# Altium project DAQ_Replacement.PrjPcb (part 3 of 3)

## Sheet GPIO_5V_LEVEL_SHIFTER.SchDoc
size A4
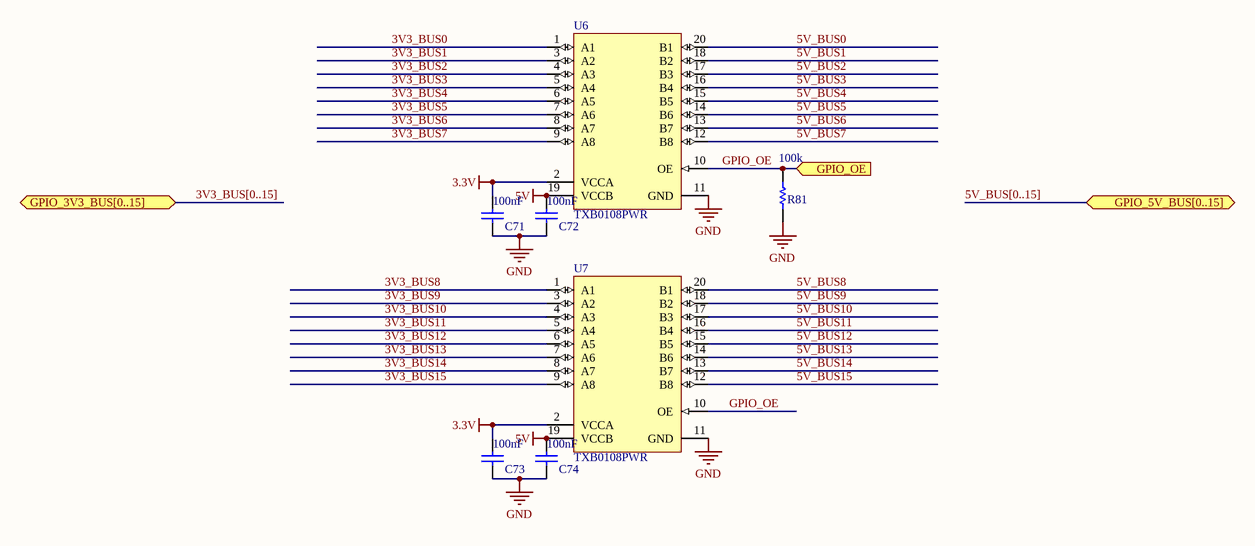
[diagram p12: GPIO_5V_LEVEL_SHIFTER.SchDoc]

### Parts
C71  value 100nF  [CAPC0402(1005)60_L]  (hidden comment: CAP0402)
C72  value 100nF  [CAPC0402(1005)60_L]  (hidden comment: CAP0402)
C73  value 100nF  [CAPC0402(1005)60_L]  (hidden comment: CAP0402)
C74  value 100nF  [CAPC0402(1005)60_L]  (hidden comment: CAP0402)
R81  value 100k  [RESC0402(1005)_L]  (hidden comment: RES0402)
U6  TXB0108PWR  [PW0020A_N]
U7  TXB0108PWR  [PW0020A_N]

### Ports
GPIO_3V3_BUS[0..15] (bidir), GPIO_5V_BUS[0..15] (bidir), GPIO_OE (in)

### Nets
3.3V: C71.1 C73.1 U6.2(VCCA) U7.2(VCCA)
5V: C72.1 C74.1 U6.19(VCCB) U7.19(VCCB)
GND: C71.2 C72.2 C73.2 C74.2 R81.1 U6.11(GND) U7.11(GND)
3V3_BUS0: U6.1(A1)
3V3_BUS1: U6.3(A2)
3V3_BUS2: U6.4(A3)
3V3_BUS3: U6.5(A4)
3V3_BUS4: U6.6(A5)
3V3_BUS5: U6.7(A6)
3V3_BUS6: U6.8(A7)
3V3_BUS7: U6.9(A8)
3V3_BUS8: U7.1(A1)
3V3_BUS9: U7.3(A2)
3V3_BUS10: U7.4(A3)
3V3_BUS11: U7.5(A4)
3V3_BUS12: U7.6(A5)
3V3_BUS13: U7.7(A6)
3V3_BUS14: U7.8(A7)
3V3_BUS15: U7.9(A8)
5V_BUS0: U6.20(B1)
5V_BUS1: U6.18(B2)
5V_BUS2: U6.17(B3)
5V_BUS3: U6.16(B4)
5V_BUS4: U6.15(B5)
5V_BUS5: U6.14(B6)
5V_BUS6: U6.13(B7)
5V_BUS7: U6.12(B8)
5V_BUS8: U7.20(B1)
5V_BUS9: U7.18(B2)
5V_BUS10: U7.17(B3)
5V_BUS11: U7.16(B4)
5V_BUS12: U7.15(B5)
5V_BUS13: U7.14(B6)
5V_BUS14: U7.13(B7)
5V_BUS15: U7.12(B8)
GPIO_OE: R81.2 U6.10(OE) U7.10(OE) ; port GPIO_OE

### Buses and harness runs
bus 3V3_BUS[0..15] = port GPIO_3V3_BUS[0..15]
bus 5V_BUS[0..15] = port GPIO_5V_BUS[0..15]

### Library data of the parts
C71-C74 = CMP-1590-00004-1: as C123-C133 on sheet MCU_USB; PackageReference: CAPC0402(1005)60
R81 = CMP-1591-00004-1: as R121-R125 on sheet MCU_USB; PackageReference: RESC0402(1005)
U6 U7 = CMP-2000-07337-1: TXB0108 8-Bit Bidirectional Voltage-Level Translator with Auto-Direction Sensing and / +/- 15-kV ESD Protection, 1.2 to 3.6 V, -40 to 85 degC, 20-Pin TSSOP (PW), Green (RoHS & no Sb/Br), Tape and Reel; Manufacturer: Texas Instruments; Propagation Delay (Max): 4ns; Logic Function: Translator,Bidirectional; Input Type: Logic; Package Version: 4040064-5/G, 02/2011; Voltage - Supply: 1.2V~3.6V,1.65V~5.5V; Data Rate: 100Mbps; Other Names: 296-21527-6; Number of Channels: 8; Differential - Input: Output:No/No; Number of Outputs/Channel: 1; Product Training Modules: VoltageLevelTranslation; Dynamic Catalog: TXBSeries; Package Reference: PW20; Package Description: 20-Pin Small Outline Package Integrated Circuit, Body 6.5 x 4.4 mm, Pitch 0.65 mm; Category: IntegratedCircuits(ICs); Datasheet URL: http://www.ti.com/general/docs/lit/getliterature.tsp?genericPartNumber=TXB0108&fileType=pdf; Package / Case: 20-TSSOP(0.173",4.40mmWidth); Family: Logic-Translators; Standard Package: 1; Series: -; Manufacturer URL: http://www.ti.com/; Number of Bits: 8; Package URL: http://www.ti.com/litv/pdf/mpds362; Output Type: Logic; Datasheet Version: Rev. F, 12/2014; Packaging: Digi-Reel®; Operating Temperature: -40°C~85°C; Supplier Device Package: 20-TSSOP; Mounting Technology: SurfaceMount

## Sheet VOLTAGE_REFERENCE.SchDoc
size A4
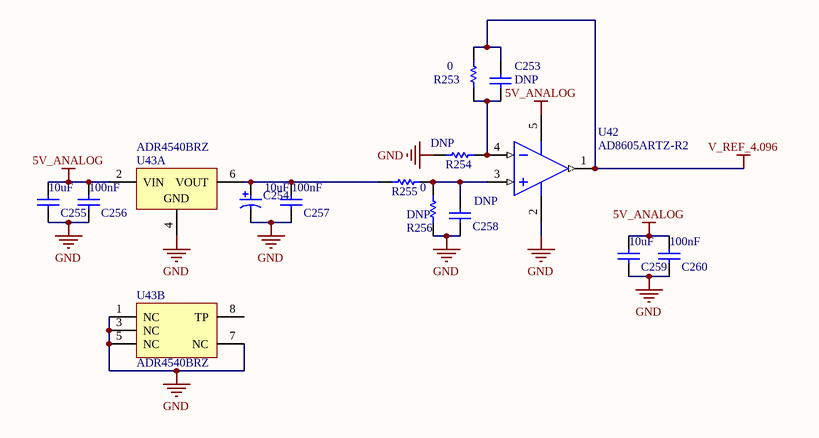
[diagram p13: VOLTAGE_REFERENCE.SchDoc]

### Parts
C253  value DNP  [CAPC0402(1005)60_L]  (hidden comment: CAP0402)
C254  Capacitance: 10uF  [KEMT-A-3216-18-2_M]  (hidden comment: T491A106K016AT)
C255  value 10uF  [CAPC0805(2012)145_L]  (hidden comment: CAP0805)
C256  value 100nF  [CAPC0402(1005)60_L]  (hidden comment: CAP0402)
C257  value 100nF  [CAPC0402(1005)60_L]  (hidden comment: CAP0402)
C258  value DNP  [CAPC0402(1005)60_L]  (hidden comment: CAP0402)
C259  value 10uF  [CAPC0805(2012)145_L]  (hidden comment: CAP0805)
C260  value 100nF  [CAPC0402(1005)60_L]  (hidden comment: CAP0402)
R253  value 0  [RESC0402(1005)_L]  (hidden comment: RES0402)
R254  value DNP  [RESC0402(1005)_L]  (hidden comment: RES0402)
R255  value 0  [RESC0402(1005)_L]  (hidden comment: RES0402)
R256  value DNP  [RESC0402(1005)_L]  (hidden comment: RES0402)
U42  AD8605ARTZ-R2  [ADI-RJ-5_L]
U43  ADR4540BRZ  [ADI-R-8_M]  (parts A,B of 2)

### Nets
5V_ANALOG: C255.2 C256.1 C259.2 C260.1 U42.5(+V) U43.2(VIN)
GND: C254.2 C255.1 C256.2 C257.2 C258.2 C259.1 C260.2 R254.1 R256.2 U42.2(-V) U43.1(NC) U43.3(NC) U43.4(GND) U43.5(NC) U43.7(NC)
V_REF_4.096: C253.1 R253.1 U42.1(OUT)
NetC253_2: C253.2 R253.2 R254.2 U42.4(-IN)
NetC254_1: C254.1 C257.1 R255.1 U43.6(VOUT)
NetC258_1: C258.1 R255.2 R256.1 U42.3(+IN)

Not connected (* = marked no-connect by the designer): U43 8(TP)

### Library data of the parts
C253 C256-C258 C260 = CMP-1590-00004-1: as C123-C133 on sheet MCU_USB; PackageReference: CAPC0402(1005)60
C254 = CMP-2000-05173-1: Capacitor, Tantalum, 10 uF, +/- 10%, 16 V, -55 to 125 degC, 2-Pin SMD (1206), RoHS, Tape and Reel; Manufacturer: Kemet; Insulation: NotRequired; Voltage: 16VDC; Product Height (mm): 1.6mm; Polarity: Polar; Lead Spacing (nom): NotRequiredmm; Product Length (mm): 3.2mm; Case Style: Molded; DCL: 1.6uA; ESR: 7ohm; DF: 8%; Mounting Style: SurfaceMount; Manufacturer URL: http://www.kemet.com/; Datasheet Version: Apr-14; Package Description: 2-Pin Surface Mount Device, Body 3.2 x 1.6 mm; Operating Temp Range: -55Cto125C; Package Reference: 1206; Wire Form: NotRequired; Datasheet URL: http://www.farnell.com/datasheets/1824869.pdf; Tolerance (+ or -): 10%; Failure Rate: NotRequired; Length W/Weld: NotRequiredmm; Package / Case: 3216-18; Seated Plane Height: NotRequiredmm; Product Diameter (mm): NotRequiredmm; Construction: SMTChip; Seal: NotRequired; Case Code: A; Product Depth (mm): 1.6mm; Packaging: TapeandReel
C255 C259 = CMP-1590-00003-1: 0805 (2012 Metric) Chip Capacitor; Case-EIA: 0805; Case-Metric: 2012; PackageReference: CAPC0805(2012)145
R253-R256 = CMP-1591-00004-1: as R121-R125 on sheet MCU_USB; PackageReference: RESC0402(1005)
U42 = CMP-0384-01518-1: Single Channel Wide Bandwidth Operational Amplifier, 10 MHz BW, 5 V/us SR, Industrial, 5-pin SOT23 (RJ-5), Reel; Generic Part Number: AD8605; Manufacturer: Analog Devices; Input Offset Voltage: 20uV; Small Signal Bandwidth: 10MHz; Slew Rate: 5V/us; V Span Min: 2.7V; Amplifiers Per Package: 1; Input Bias Current: 200fA; V Span Max: 6V; Iq/Amp: 1.2mA; ComponentLink2URL: http://www.analog.com/static/imported-files/data_sheets/AD8605_8606_8608.pdf; Code_JEDEC: MO-178-AA; ComponentLink1URL: http://www.analog.com/en/index.html; ComponentLink1Description: Manufacturer URL; Mounting Technology: Surface Mount; PackageReference: RJ-5; ComponentLink3Description: Package Specification; ComponentLink3URL: http://www.analog.com/static/imported-files/packages/PKG_PDF/SOT-23(RJ)/RJ_5.pdf; PackageDescription: 5-Pin Small Outline Transistor Package, Body 2.9 x 1.6 mm, Pitch 0.95 mm; PackageVersion: 121608-A; PartNumber: AD8605ARTZ-R2; ComponentLink2Description: Datasheet; ComponentLink4Description: URL Link1; ComponentLink4URL: Reference Circuit:http://www.analog.com/en/all-operational-amplifiers-op-amps/operational-amplifiers-op-amps/ad8605/products/product.html#product-recommendations; DatasheetVersion: Rev. L
U43 = CMP-0784-00192-1: Ultralow Noise, High Accuracy Voltage Reference, 4.096 V Output, 3 to 15 V Supply, Industrial, 8-pin SOIC (R-8), Tube; Manufacturer: Analog Devices; Max V Supply (V): 15; Min V Supply (V): 3; Vout: 4.096V; Ref Out TC (ppm/C): 2; ComponentLink4URL: Product URL:http://www.analog.com/en/special-linear-functions/voltage-references/adr4540/products/product.html; Mounting Technology: Surface Mount; ComponentLink1Description: Manufacturer URL; PackageDescription: 8-Pin Standard Small Outline Package, Body 4.9 x 3.9 mm, Pitch 1.27 mm; ComponentLink2URL: http://www.analog.com/static/imported-files/data_sheets/ADR4520_4525_4530_4533_4540_4550.pdf; ComponentLink1URL: http://www.analog.com/en/index.html; DatasheetVersion: Rev. 0; ComponentLink4Description: URL Link1; Operating Temp Range: -40 to 125 degC; PartNumber: ADR4540BRZ; ComponentLink2Description: Datasheet; ComponentLink3URL: http://www.analog.com/static/imported-files/packages/PKG_PDF/SOIC_Narrow%20(R)/R_8.pdf; ComponentLink3Description: Package Specification; PackageVersion: 060506-A, 06/2006; Packing: Tube; PackageReference: R-8; Code_JEDEC: MS-012-AA

## Sheet PSU_USB_MCU.SchDoc
size A4
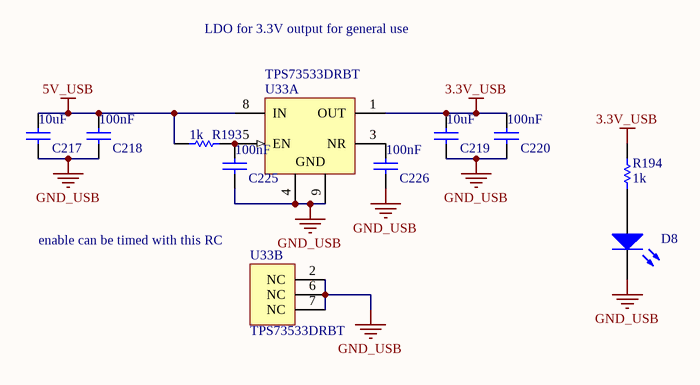
[diagram p14: PSU_USB_MCU.SchDoc]

### Parts
C217  value 10uF  [CAPC0805(2012)145_L]  (hidden comment: CAP0805)
C218  value 100nF  [CAPC0402(1005)60_L]  (hidden comment: CAP0402)
C219  value 10uF  [CAPC0805(2012)145_L]  (hidden comment: CAP0805)
C220  value 100nF  [CAPC0402(1005)60_L]  (hidden comment: CAP0402)
C225  value 100nF  [CAPC0402(1005)60_L]  (hidden comment: CAP0402)
C226  value 100nF  [CAPC0402(1005)60_L]  (hidden comment: CAP0402)
D8  Green_LED_150060GS75000  [Green_LED_150060GS75000]  (value not drawn)
R193  value 1k  [RESC0402(1005)_L]  (hidden comment: RES0402)
R194  value 1k  [RESC0402(1005)_L]  (hidden comment: RES0402)
U33  TPS73533DRBT  [DRB0008A_V]  (parts A,B of 2)

### Nets
3.3V_USB: C219.2 C220.1 R194.1 U33.1(OUT)
5V_USB: C217.2 C218.1 R193.2 U33.8(IN)
GND_USB: C217.1 C218.2 C219.1 C220.2 C225.2 C226.2 D8.1 U33.2(NC) U33.4(GND) U33.6(NC) U33.7(NC) U33.9(GND)
NetC225_1: C225.1 R193.1 U33.5(EN)
NetC226_1: C226.1 U33.3(NR)
NetD8_2: D8.2 R194.2

### Notes on the sheet
- LDO for 3.3V output for general use
- enable can be timed with this RC

### Library data of the parts
C217 C219 = CMP-1590-00003-1: as C255 on sheet VOLTAGE_REFERENCE; PackageReference: CAPC0805(2012)145
C218 C220 C225 C226 = CMP-1590-00004-1: as C123-C133 on sheet MCU_USB; PackageReference: CAPC0402(1005)60
D8 = Green_LED_150060GS75000: WURTH ELEKTRONIK  150060GS75000  LED, Green, SMD, 30 mA, 3.2 V, 520 nm; Unit Cost: 0.287; ComponentLinkURL1: http://ie.farnell.com/wurth-elektronik/150060gs75000/led-0603-green-430mcd-520nm/dp/2322070?ost=150060GS75000&selectedCategoryId=&categoryNameResp=All%2BCategories&searchView=table&iscrfnonsku=false; Manufacturer Part Number: 150060GS75000; Supplier 1: Farnell; Supplier Part Number 1: 2322070; Manufacturer: WURTH ELEKTRONIK
R193 R194 = CMP-1591-00004-1: as R121-R125 on sheet MCU_USB; PackageReference: RESC0402(1005)
U33 = CMP-0395-00583-2: Single Output High PSRR LDO, 500 mA, Fixed 3.3 V Output, 2.7 to 6.5 V Input, with Low IQ, 8-pin SON (DRB), -40 to 125 degC, Green (RoHS & no Sb/Br); Manufacturer: Texas Instruments; SubFamily: Single Channel LDO; Vout Adj(Min)(V): 3.3; Iq(Typ)(mA): 0.04; Vdo(Typ)(mV): 280; Vin(Min)(V): 2.7; Vin(Max)(V): 6.5; Accuracy(%): 2; Iout(Max)(A): 0.5; ComponentLink3Description: Package Specification; ComponentLink2Description: Datasheet; DatasheetVersion: SBVS087J; ComponentLink1Description: Manufacturer URL; PartNumber: TPS73533DRBT; ComponentLink2URL: http://www.ti.com/general/docs/lit/getliterature.tsp?genericPartNumber=TPS73533&fileType=pdf; ComponentLink3URL: http://www.ti.com/litv/pdf/mpds118h; Fixed Output Options(V): 3.3; Eco-Plan: Green (RoHS & no Sb/Br); ComponentLink1URL: http://www.ti.com/; PackageDescription: 8-Pin Plastic Small Outline, Body 3 x 3 mm, Pitch 0.65 mm; Mounting Technology: Surface Mount; PackageVersion: 4203482-2/K; Vout Adj(Max)(V): 3.3; PackageReference: DRB0008A

## Sheet PSU_DAQ_MCU.SchDoc
size A4
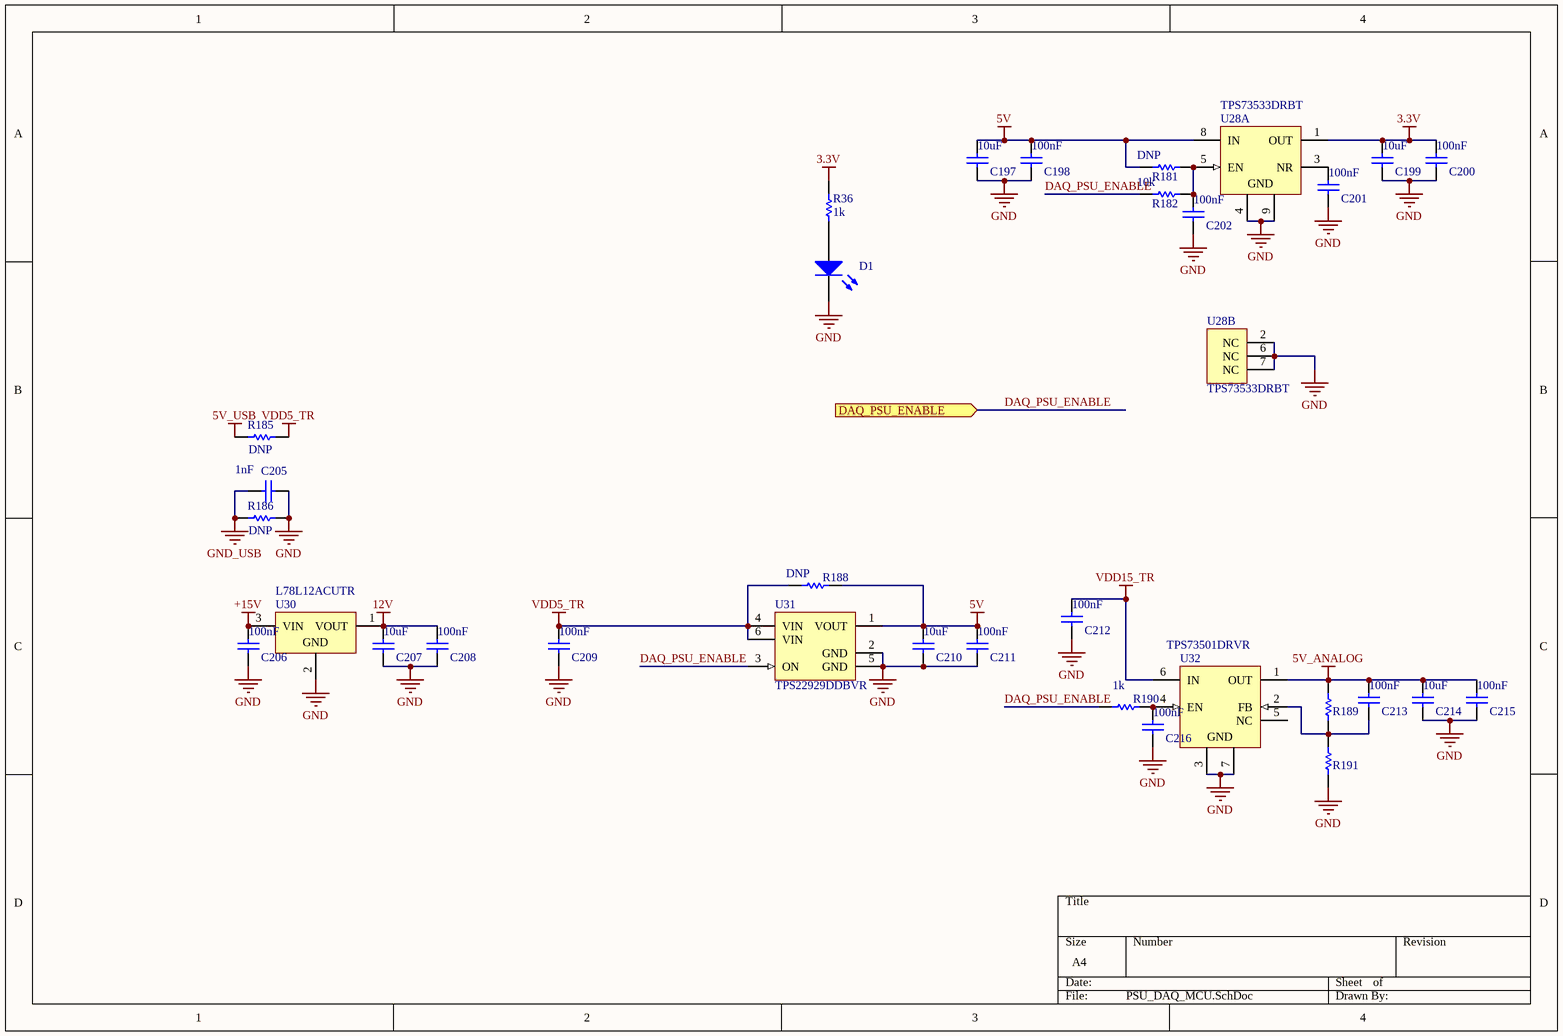
[diagram p15: PSU_DAQ_MCU.SchDoc]

### Parts
C197  value 10uF  [CAPC0805(2012)145_L]  (hidden comment: CAP0805)
C198  value 100nF  [CAPC0402(1005)60_L]  (hidden comment: CAP0402)
C199  value 10uF  [CAPC0805(2012)145_L]  (hidden comment: CAP0805)
C200  value 100nF  [CAPC0402(1005)60_L]  (hidden comment: CAP0402)
C201  value 100nF  [CAPC0402(1005)60_L]  (hidden comment: CAP0402)
C202  value 100nF  [CAPC0402(1005)60_L]  (hidden comment: CAP0402)
C205  value 1nF  [CAPC1808(4520)175_L]  (hidden comment: CAP1808)
C206  value 100nF  [CAPC0402(1005)60_L]  (hidden comment: CAP0402)
C207  value 10uF  [CAPC0805(2012)145_L]  (hidden comment: CAP0805)
C208  value 100nF  [CAPC0402(1005)60_L]  (hidden comment: CAP0402)
C209  value 100nF  [CAPC0402(1005)60_L]  (hidden comment: CAP0402)
C210  value 10uF  [CAPC0805(2012)145_L]  (hidden comment: CAP0805)
C211  value 100nF  [CAPC0402(1005)60_L]  (hidden comment: CAP0402)
C212  value 100nF  [CAPC0402(1005)60_L]  (hidden comment: CAP0402)
C213  value 100nF  [CAPC0402(1005)60_L]  (hidden comment: CAP0402)
C214  value 10uF  [CAPC0805(2012)145_L]  (hidden comment: CAP0805)
C215  value 100nF  [CAPC0402(1005)60_L]  (hidden comment: CAP0402)
C216  value 100nF  [CAPC0402(1005)60_L]  (hidden comment: CAP0402)
D1  Green_LED_150060GS75000  [Green_LED_150060GS75000]  (value not drawn)
R36  value 1k  [RESC0402(1005)_L]  (hidden comment: RES0402)
R181  value DNP  [RESC0402(1005)_L]  (hidden comment: RES0402)
R182  value 10k  [RESC0402(1005)_L]  (hidden comment: RES0402)
R185  value DNP  [RESC2010(5025)_L]  (hidden comment: RES2010)
R186  value DNP  [RESC2010(5025)_L]  (hidden comment: RES2010)
R188  value DNP  [RESC0402(1005)_L]  (hidden comment: RES0402)
R189  RES0402  [RESC0402(1005)_L]  (value not drawn)
R190  value 1k  [RESC0402(1005)_L]  (hidden comment: RES0402)
R191  RES0402  [RESC0402(1005)_L]  (value not drawn)
U28  TPS73533DRBT  [DRB0008A_V]  (parts A,B of 2)
U30  L78L12ACUTR  [SOT-89_N]
U31  TPS22929DDBVR  [DBV6_N]
U32  TPS73501DRVR  [TI-DRV6-1600X1000TP_V]

### Ports
DAQ_PSU_ENABLE (in)

### Nets
3.3V: C199.2 C200.1 R36.1 U28.1(OUT)
5V: C197.2 C198.1 C210.2 C211.1 R181.1 R188.1 U28.8(IN) U31.1(VOUT)
5V_ANALOG: C213.1 C214.2 C215.1 R189.1 U32.1(OUT)
5V_USB: R185.1
12V: C207.2 C208.1 U30.1(VOUT)
+15V: C206.1 U30.3(VIN)
GND: C197.1 C198.2 C199.1 C200.2 C201.2 C202.2 C205.2 C206.2 C207.1 C208.2 C209.2 C210.1 C211.2 C212.2 C214.1 C215.2 C216.2 D1.1 R186.2 R191.2 U28.2(NC) U28.4(GND) U28.6(NC) U28.7(NC) U28.9(GND) U30.2(GND) U31.2(GND) U31.5(GND) U32.3(GND) U32.7(GND)
GND_USB: C205.1 R186.1
VDD5_TR: C209.1 R185.2 R188.2 U31.4(VIN) U31.6(VIN)
VDD15_TR: C212.1 U32.6(IN)
DAQ_PSU_ENABLE: R182.1 R190.2 U31.3(ON) ; port DAQ_PSU_ENABLE
NetC201_1: C201.1 U28.3(NR)
NetC202_1: C202.1 R181.2 R182.2 U28.5(EN)
NetC213_2: C213.2 R189.2 R191.1 U32.2(FB)
NetC216_1: C216.1 R190.1 U32.4(EN)
NetD1_2: D1.2 R36.2

Not connected (* = marked no-connect by the designer): U32 5(NC)

### Library data of the parts
C197 C199 C207 C210 C214 = CMP-1590-00003-1: as C255 on sheet VOLTAGE_REFERENCE; PackageReference: CAPC0805(2012)145
C198 C200-C202 C206 C208 C209 C211-C213 C215 C216 = CMP-1590-00004-1: as C123-C133 on sheet MCU_USB; PackageReference: CAPC0402(1005)60
C205 = CMP-1590-00006-1: 1808 (4520 Metric) Chip Capacitor; Case-Metric: 4520; Case-EIA: 1808; PackageReference: CAPC1808(4520)175
D1 = Green_LED_150060GS75000: as D8 on sheet PSU_USB_MCU; ComponentLinkURL1: http://ie.farnell.com/wurth-elektronik/150060gs75000/led-0603-green-430mcd-520nm/dp/2322070?ost=150060GS75000&selectedCategoryId=&categoryNameResp=All%2BCategories&searchView=table&iscrfnonsku=false; Manufacturer Part Number: 150060GS75000; Supplier 1: Farnell; Supplier Part Number 1: 2322070; Manufacturer: WURTH ELEKTRONIK
R36 R181 R182 R188-R191 = CMP-1591-00004-1: as R121-R125 on sheet MCU_USB; PackageReference: RESC0402(1005)
R185 R186 = CMP-1591-00006-1: 2010 (5025 Metric) Chip Resistor; Case-Metric: 5025; Case-EIA: 2010; PackageReference: RESC2010(5025)
U28 = CMP-0395-00583-2: as U33 on sheet PSU_USB_MCU; ComponentLink3Description: Package Specification; ComponentLink2Description: Datasheet; DatasheetVersion: SBVS087J; ComponentLink1Description: Manufacturer URL; PartNumber: TPS73533DRBT; ComponentLink2URL: http://www.ti.com/general/docs/lit/getliterature.tsp?genericPartNumber=TPS73533&fileType=pdf; ComponentLink3URL: http://www.ti.com/litv/pdf/mpds118h; Fixed Output Options(V): 3.3; Eco-Plan: Green (RoHS & no Sb/Br); ComponentLink1URL: http://www.ti.com/; PackageDescription: 8-Pin Plastic Small Outline, Body 3 x 3 mm, Pitch 0.65 mm; Mounting Technology: Surface Mount; PackageVersion: 4203482-2/K; Vout Adj(Max)(V): 3.3; PackageReference: DRB0008A
U30 = CMP-0244-00387-1: Positive Voltage Regulator, 12V, 4-Pin SOT-89, Tape and Reel; DatasheetVersion: 1/02/2011; PackageDescription: 3-Pin SOT-89 Package 1.5 mm Pitch, 4.1 mm Lead Span; ComponentLink2Description: Datasheet; ComponentLink1Description: Manufacturer URL; PackageVersion: 2011; PackageReference: SOT-89; ComponentLink1URL: http://www.st.com; ComponentLink2URL: http://www.st.com/internet/com/TECHNICAL_RESOURCES/TECHNICAL_LITERATURE/DATASHEET/CD00000446.pdf
U31 = CMP-0330-00011-1: Low Input Voltage, 1.8 A Single Channel Load Switch with Controlled Turn-On, 1.8 V Logic Compatible, 1.8 A, 1.4 to 5.5 V, -40 to 85 degC, 6-pin SOT-23 (DBV), Green (RoHS & no Sb/Br); Manufacturer: Texas Instruments; Quick Output Discharge Transistor: Yes; SubFamily: Non Current Limited Load Switch; Iin(nA): 10000; Control Logic: 1.8-V Logic Compatible; HBM ESD(kV): 2; Vin(V): 1.4 - 5.5; Active High Enable: TRUE; Output Rise Time(ÂµS): 4500; Imax(A): 1.8; rON @1.8V(mOhm): 85; PartNumber: TPS22929DDBVR; Eco-Plan: Green (RoHS & no Sb/Br); ComponentLink1Description: Datasheet; DatasheetVersion: SLVSB39; PackageReference: DBV6; PackageVersion: revK, Mar-2006; PackageDescription: 6-Pin Plastic Small-Outline Package, 2.9 x 1.6 mm Body, 0.95 mm Pitch, 2.8 mm Lead Span; ComponentLink1URL: http://www.ti.com/general/docs/lit/getliterature.tsp?genericPartNumber=TPS22929D&fileType=pdf; Code_JEDEC: MO-178-AB*; Mounting Technology: Surface Mount
U32 = CMP-0395-00669-1: Single Output High PSRR LDO, 500 mA, Adjustable 1.25 to 6 V Output, 2.7 to 6.5 V Input, with Low IQ, 6-pin SON (DRV), -40 to 125 degC, Green (RoHS & no Sb/Br); Manufacturer: Texas Instruments; SubFamily: Single Channel LDO; Vin(Max)(V): 6.5; Vin(Min)(V): 2.7; Vout Adj(Min)(V): 1.25; Vdo(Typ)(mV): 280; Accuracy(%): 2; Iout(Max)(A): 0.5; Iq(Typ)(mA): 0.04; Vout Adj(Max)(V): 6; ComponentLink1Description: Manufacturer URL; ComponentLink2URL: http://www.ti.com/general/docs/lit/getliterature.tsp?genericPartNumber=TPS73501&fileType=pdf; PackageReference: DRV6-1600X1000TP; ComponentLink2Description: Datasheet; Mounting Technology: Surface Mount; PackageVersion: 4206925/E; DatasheetVersion: SBVS087J; Eco-Plan: Green (RoHS & no Sb/Br); ComponentLink1URL: http://www.ti.com/; PartNumber: TPS73501DRVR; ComponentLink3URL: http://www.ti.com/litv/pdf/mpds216d; PackageDescription: 6-Pin Plastic Small Outline No-Lead, Body 2 x 2 mm, Pitch 0.65 mm; ComponentLink3Description: Package Specification

## Nets that join several sheets
3.3V: ADC1 (9 pins), ADC2 (9 pins), OPTO_ISOLATION (8 pins), DIAGNOSTIC_ADC (5 pins), MCU_DAQ (20 pins), MCU_USB (R139.2 R140.2), Phase_Modulator_Transmitter (7 pins), INPUTS_OUTPUTS (R94.1), GPIO_5V_LEVEL_SHIFTER (C71.1 C73.1 U6.2 U7.2), PSU_DAQ_MCU (C199.2 C200.1 R36.1 U28.1)
3.3V_USB: USB (Q4.3 R236.2), OPTO_ISOLATION (8 pins), WIFI_BLE_Option (C261.1 R258.2 U45.4 U45.6), MCU_USB (20 pins), PSU_USB_MCU (C219.2 C220.1 R194.1 U33.1)
5V: ADC1 (C21_ADC1.1 C22_ADC1.2 U1_ADC1.27), ADC2 (C21_ADC2.1 C22_ADC2.2 U1_ADC2.27), DIAGNOSTIC_ADC (R67.1), INPUTS_OUTPUTS (DAQ1.1 DAQ1.2 DAQ1.51 DAQ1.52), GPIO_5V_LEVEL_SHIFTER (C72.1 C74.1 U6.19 U7.19), PSU_DAQ_MCU (8 pins)
5V_ANALOG: ADC1 (C19_ADC1.2 C20_ADC1.1 U1_ADC1.28), ADC2 (C19_ADC2.2 C20_ADC2.1 U1_ADC2.28), DIAGNOSTIC_ADC (R68.1), Phase_Modulator_Transmitter (5 pins), VOLTAGE_REFERENCE (6 pins), PSU_DAQ_MCU (5 pins)
5V_USB: USB (J4.1 R250.1 U41.4), PSU_USB_MCU (C217.2 C218.1 R193.2 U33.8), PSU_DAQ_MCU (R185.1)
12V: DIAGNOSTIC_ADC (R71.1), Phase_Modulator_Transmitter (R163.1 R164.1 R168.2 R169.2), PSU_DAQ_MCU (C207.2 C208.1 U30.1)
15V: ADC1 (C34_ADC1.1 C35_ADC1.2 U1_ADC1.39), ADC2 (C34_ADC2.1 C35_ADC2.2 U1_ADC2.39), DIAGNOSTIC_ADC (R69.1)
+15V: Bipolar_PSU_Sheet (5 pins), Phase_Modulator_Transmitter (6 pins), PSU_DAQ_MCU (C206.1 U30.3)
-15V: ADC1 (C32_ADC1.2 C33_ADC1.1 U1_ADC1.38 U1_ADC1.41), ADC2 (C32_ADC2.2 C33_ADC2.1 U1_ADC2.38 U1_ADC2.41), Bipolar_PSU_Sheet (5 pins), DIAGNOSTIC_ADC (R73.1), Phase_Modulator_Transmitter (6 pins)
GND: ADC1 (39 pins), ADC1/ADC_INPUT_FILTER (16 pins), ADC2 (39 pins), ADC2/ADC_INPUT_FILTER (16 pins), OPTO_ISOLATION (10 pins), Bipolar_PSU_Sheet (16 pins), DIAGNOSTIC_ADC (21 pins), MCU_DAQ (32 pins), Phase_Modulator_Transmitter (50 pins), INPUTS_OUTPUTS (58 pins), GPIO_5V_LEVEL_SHIFTER (7 pins), VOLTAGE_REFERENCE (15 pins), PSU_DAQ_MCU (30 pins)
GND_USB: USB (6 pins), OPTO_ISOLATION (9 pins), WIFI_BLE_Option (15 pins), MCU_USB (33 pins), PSU_USB_MCU (12 pins), PSU_DAQ_MCU (C205.1 R186.1)
V_REF_4.096: ADC1 (6 pins), ADC2 (6 pins), DIAGNOSTIC_ADC (R65.2 R70.1), VOLTAGE_REFERENCE (C253.1 R253.1 U42.1)
VDD5_TR: OPTO_ISOLATION (R150.2), INPUTS_OUTPUTS (P3.7 P3.8), PSU_DAQ_MCU (5 pins)
VDD15_TR: INPUTS_OUTPUTS (P3.1), PSU_DAQ_MCU (C212.1 U32.6)
VDD_AMP_TR: Bipolar_PSU_Sheet (FB4.2), INPUTS_OUTPUTS (P3.3)
VSS_AMP_TR: Bipolar_PSU_Sheet (FB3.1), INPUTS_OUTPUTS (P3.4)
3V3_BUS0: MCU_DAQ (U11.81), GPIO_5V_LEVEL_SHIFTER (U6.1)
3V3_BUS1: MCU_DAQ (U11.82), GPIO_5V_LEVEL_SHIFTER (U6.3)
3V3_BUS2: MCU_DAQ (U11.83), GPIO_5V_LEVEL_SHIFTER (U6.4)
3V3_BUS3: MCU_DAQ (U11.84), GPIO_5V_LEVEL_SHIFTER (U6.5)
3V3_BUS4: MCU_DAQ (U11.85), GPIO_5V_LEVEL_SHIFTER (U6.6)
3V3_BUS5: MCU_DAQ (U11.86), GPIO_5V_LEVEL_SHIFTER (U6.7)
3V3_BUS6: MCU_DAQ (U11.87), GPIO_5V_LEVEL_SHIFTER (U6.8)
3V3_BUS7: MCU_DAQ (U11.88), GPIO_5V_LEVEL_SHIFTER (U6.9)
3V3_BUS8: MCU_DAQ (U11.55), GPIO_5V_LEVEL_SHIFTER (U7.1)
3V3_BUS9: MCU_DAQ (U11.56), GPIO_5V_LEVEL_SHIFTER (U7.3)
3V3_BUS10: MCU_DAQ (U11.57), GPIO_5V_LEVEL_SHIFTER (U7.4)
3V3_BUS11: MCU_DAQ (U11.58), GPIO_5V_LEVEL_SHIFTER (U7.5)
3V3_BUS12: MCU_DAQ (U11.59), GPIO_5V_LEVEL_SHIFTER (U7.6)
3V3_BUS13: MCU_DAQ (U11.60), GPIO_5V_LEVEL_SHIFTER (U7.7)
3V3_BUS14: MCU_DAQ (U11.61), GPIO_5V_LEVEL_SHIFTER (U7.8)
3V3_BUS15: MCU_DAQ (U11.62), GPIO_5V_LEVEL_SHIFTER (U7.9)
5V_BUS0: INPUTS_OUTPUTS (DAQ1.3), GPIO_5V_LEVEL_SHIFTER (U6.20)
5V_BUS1: INPUTS_OUTPUTS (DAQ1.5), GPIO_5V_LEVEL_SHIFTER (U6.18)
5V_BUS2: INPUTS_OUTPUTS (DAQ1.7), GPIO_5V_LEVEL_SHIFTER (U6.17)
5V_BUS3: INPUTS_OUTPUTS (DAQ1.9), GPIO_5V_LEVEL_SHIFTER (U6.16)
5V_BUS4: INPUTS_OUTPUTS (DAQ1.11), GPIO_5V_LEVEL_SHIFTER (U6.15)
5V_BUS5: INPUTS_OUTPUTS (DAQ1.13), GPIO_5V_LEVEL_SHIFTER (U6.14)
5V_BUS6: INPUTS_OUTPUTS (DAQ1.15), GPIO_5V_LEVEL_SHIFTER (U6.13)
5V_BUS7: INPUTS_OUTPUTS (DAQ1.17), GPIO_5V_LEVEL_SHIFTER (U6.12)
5V_BUS8: INPUTS_OUTPUTS (DAQ1.69), GPIO_5V_LEVEL_SHIFTER (U7.20)
5V_BUS9: INPUTS_OUTPUTS (DAQ1.71), GPIO_5V_LEVEL_SHIFTER (U7.18)
5V_BUS10: INPUTS_OUTPUTS (DAQ1.73), GPIO_5V_LEVEL_SHIFTER (U7.17)
5V_BUS11: INPUTS_OUTPUTS (DAQ1.75), GPIO_5V_LEVEL_SHIFTER (U7.16)
5V_BUS12: INPUTS_OUTPUTS (DAQ1.77), GPIO_5V_LEVEL_SHIFTER (U7.15)
5V_BUS13: INPUTS_OUTPUTS (DAQ1.79), GPIO_5V_LEVEL_SHIFTER (U7.14)
5V_BUS14: INPUTS_OUTPUTS (DAQ1.81), GPIO_5V_LEVEL_SHIFTER (U7.13)
5V_BUS15: INPUTS_OUTPUTS (DAQ1.83), GPIO_5V_LEVEL_SHIFTER (U7.12)
ADC_INPUT0: ADC1/ADC_INPUT_FILTER (R1_ADC1_ADC_INPUT_FILTER.1 R2_ADC1_ADC_INPUT_FILTER.1), INPUTS_OUTPUTS (DAQ1.30)
ADC_INPUT1: ADC1/ADC_INPUT_FILTER (R3_ADC1_ADC_INPUT_FILTER.1 R4_ADC1_ADC_INPUT_FILTER.2), INPUTS_OUTPUTS (DAQ1.36)
ADC_INPUT2: ADC1/ADC_INPUT_FILTER (R5_ADC1_ADC_INPUT_FILTER.1 R6_ADC1_ADC_INPUT_FILTER.1), INPUTS_OUTPUTS (DAQ1.42)
ADC_INPUT3: ADC1/ADC_INPUT_FILTER (R7_ADC1_ADC_INPUT_FILTER.1 R8_ADC1_ADC_INPUT_FILTER.2), INPUTS_OUTPUTS (DAQ1.48)
ADC_INPUT4: ADC1/ADC_INPUT_FILTER (R9_ADC1_ADC_INPUT_FILTER.1 R10_ADC1_ADC_INPUT_FILTER.1), INPUTS_OUTPUTS (DAQ1.31)
ADC_INPUT5: ADC1/ADC_INPUT_FILTER (R11_ADC1_ADC_INPUT_FILTER.1 R12_ADC1_ADC_INPUT_FILTER.2), INPUTS_OUTPUTS (DAQ1.37)
ADC_INPUT6: ADC1/ADC_INPUT_FILTER (R13_ADC1_ADC_INPUT_FILTER.1 R14_ADC1_ADC_INPUT_FILTER.1), INPUTS_OUTPUTS (DAQ1.43)
ADC_INPUT7: ADC1/ADC_INPUT_FILTER (R15_ADC1_ADC_INPUT_FILTER.1 R16_ADC1_ADC_INPUT_FILTER.2), INPUTS_OUTPUTS (DAQ1.49)
ADC_OUTC0: Phase_Modulator_Transmitter (R175.1), INPUTS_OUTPUTS (DAQ1.39)
BUSY: ADC1 (R27_ADC1.2 R32_ADC1.1 U1_ADC1.19), MCU_DAQ (U11.96)
CNV: ADC1 (C36_ADC1.1 R33_ADC1.1 U1_ADC1.20), MCU_DAQ (U11.92)
CSB: ADC1 (R26_ADC1.2 R31_ADC1.1 U1_ADC1.11), MCU_DAQ (U11.51)
DAQ_PSU_ENABLE: OPTO_ISOLATION (U3.2), MCU_USB (U14.81 U14.83)
DAQ_PSU_ENABLE: OPTO_ISOLATION (U3.15), Bipolar_PSU_Sheet (U2.5 U4.5), PSU_DAQ_MCU (R182.1 R190.2 U31.3)
DIN: ADC1 (R28_ADC1.1 U1_ADC1.12), MCU_DAQ (U11.54), Phase_Modulator_Transmitter (U23.11)
GPIO_OE: MCU_DAQ (U11.40), GPIO_5V_LEVEL_SHIFTER (R81.2 U6.10 U7.10)
I2C3_SCL: OPTO_ISOLATION (U19.3), MCU_USB (R140.1 U14.67)
I2C3_SDA: OPTO_ISOLATION (U19.2), MCU_USB (R139.1 U14.66)
IN0_ADC1: ADC1 (U1_ADC1.1), ADC1/ADC_INPUT_FILTER (C1_ADC1_ADC_INPUT_FILTER.1 C2_ADC1_ADC_INPUT_FILTER.2 R2_ADC1_ADC_INPUT_FILTER.2)
IN0_ADC2: ADC2 (U1_ADC2.1), ADC2/ADC_INPUT_FILTER (C1_ADC2_ADC_INPUT_FILTER.1 C2_ADC2_ADC_INPUT_FILTER.2 R2_ADC2_ADC_INPUT_FILTER.2)
IN1_ADC1: ADC1 (U1_ADC1.2), ADC1/ADC_INPUT_FILTER (C2_ADC1_ADC_INPUT_FILTER.1 C3_ADC1_ADC_INPUT_FILTER.2 R3_ADC1_ADC_INPUT_FILTER.2)
IN1_ADC2: ADC2 (U1_ADC2.2), ADC2/ADC_INPUT_FILTER (C2_ADC2_ADC_INPUT_FILTER.1 C3_ADC2_ADC_INPUT_FILTER.2 R3_ADC2_ADC_INPUT_FILTER.2)
IN2_ADC1: ADC1 (U1_ADC1.3), ADC1/ADC_INPUT_FILTER (C4_ADC1_ADC_INPUT_FILTER.1 C5_ADC1_ADC_INPUT_FILTER.2 R6_ADC1_ADC_INPUT_FILTER.2)
IN2_ADC2: ADC2 (U1_ADC2.3), ADC2/ADC_INPUT_FILTER (C4_ADC2_ADC_INPUT_FILTER.1 C5_ADC2_ADC_INPUT_FILTER.2 R6_ADC2_ADC_INPUT_FILTER.2)
IN3_ADC1: ADC1 (U1_ADC1.4), ADC1/ADC_INPUT_FILTER (C5_ADC1_ADC_INPUT_FILTER.1 C6_ADC1_ADC_INPUT_FILTER.2 R7_ADC1_ADC_INPUT_FILTER.2)
IN3_ADC2: ADC2 (U1_ADC2.4), ADC2/ADC_INPUT_FILTER (C5_ADC2_ADC_INPUT_FILTER.1 C6_ADC2_ADC_INPUT_FILTER.2 R7_ADC2_ADC_INPUT_FILTER.2)
IN4_ADC1: ADC1 (U1_ADC1.6), ADC1/ADC_INPUT_FILTER (C7_ADC1_ADC_INPUT_FILTER.1 C8_ADC1_ADC_INPUT_FILTER.2 R10_ADC1_ADC_INPUT_FILTER.2)
IN4_ADC2: ADC2 (U1_ADC2.6), ADC2/ADC_INPUT_FILTER (C7_ADC2_ADC_INPUT_FILTER.1 C8_ADC2_ADC_INPUT_FILTER.2 R10_ADC2_ADC_INPUT_FILTER.2)
IN5_ADC1: ADC1 (U1_ADC1.7), ADC1/ADC_INPUT_FILTER (C8_ADC1_ADC_INPUT_FILTER.1 C9_ADC1_ADC_INPUT_FILTER.2 R11_ADC1_ADC_INPUT_FILTER.2)
IN5_ADC2: ADC2 (U1_ADC2.7), ADC2/ADC_INPUT_FILTER (C8_ADC2_ADC_INPUT_FILTER.1 C9_ADC2_ADC_INPUT_FILTER.2 R11_ADC2_ADC_INPUT_FILTER.2)
IN6_ADC1: ADC1 (U1_ADC1.8), ADC1/ADC_INPUT_FILTER (C10_ADC1_ADC_INPUT_FILTER.1 C11_ADC1_ADC_INPUT_FILTER.2 R14_ADC1_ADC_INPUT_FILTER.2)
IN6_ADC2: ADC2 (U1_ADC2.8), ADC2/ADC_INPUT_FILTER (C10_ADC2_ADC_INPUT_FILTER.1 C11_ADC2_ADC_INPUT_FILTER.2 R14_ADC2_ADC_INPUT_FILTER.2)
IN7_ADC1: ADC1 (U1_ADC1.9), ADC1/ADC_INPUT_FILTER (C11_ADC1_ADC_INPUT_FILTER.1 C12_ADC1_ADC_INPUT_FILTER.2 R15_ADC1_ADC_INPUT_FILTER.2)
IN7_ADC2: ADC2 (U1_ADC2.9), ADC2/ADC_INPUT_FILTER (C11_ADC2_ADC_INPUT_FILTER.1 C12_ADC2_ADC_INPUT_FILTER.2 R15_ADC2_ADC_INPUT_FILTER.2)
INPUT0: OPTO_ISOLATION (U3.11), INPUTS_OUTPUTS (R95.4)
INPUT1: OPTO_ISOLATION (U3.10), DIAGNOSTIC_ADC (U5.6)
INPUT_BUS_USB0: OPTO_ISOLATION (U3.6), MCU_USB (U14.97)
INPUT_BUS_USB1: OPTO_ISOLATION (U3.7), MCU_USB (U14.98)
MISO: OPTO_ISOLATION (U20.16), MCU_DAQ (U11.43), INPUTS_OUTPUTS (R95.1)
MOSI: OPTO_ISOLATION (U20.17), MCU_DAQ (U11.44), INPUTS_OUTPUTS (R93.4)
NetJ4_2: USB (J4.2 U41.3), MCU_USB (U14.70)
NetJ4_3: USB (J4.3 R249.1 U41.1), MCU_USB (U14.71)
NetU14_40: OPTO_ISOLATION (U20.9), MCU_USB (U14.40)
NetU14_42: OPTO_ISOLATION (U20.6), MCU_USB (U14.42)
NetU14_43: OPTO_ISOLATION (U20.3), MCU_USB (U14.43)
NetU14_44: OPTO_ISOLATION (U20.5), MCU_USB (U14.44)
NetU14_45: OPTO_ISOLATION (U20.4), MCU_USB (U14.45)
NetU14_95: OPTO_ISOLATION (U20.7), MCU_USB (U14.95)
NetU14_96: OPTO_ISOLATION (U20.8), MCU_USB (U14.96)
OUTPUT1: OPTO_ISOLATION (U3.14), INPUTS_OUTPUTS (R95.2)
OUTPUT2: OPTO_ISOLATION (U3.13), INPUTS_OUTPUTS (R95.3)
OUTPUT_BUS_USB1: OPTO_ISOLATION (U3.3), MCU_USB (U14.82)
OUTPUT_BUS_USB2: OPTO_ISOLATION (U3.4), MCU_USB (U14.85)
OUTPUT_BUS_USB3: OPTO_ISOLATION (U3.5), MCU_USB (U14.86)
PB7: ADC1 (R24_ADC1.2 R29_ADC1.1 U1_ADC1.13), MCU_DAQ (U11.93)
PB8: ADC1 (R25_ADC1.2 R30_ADC1.1 U1_ADC1.15), MCU_DAQ (U11.95)
PB13: ADC1 (R20_ADC1.2 R21_ADC1.1 U1_ADC1.16), MCU_DAQ (U11.52), Phase_Modulator_Transmitter (U23.12)
PB14: ADC1 (R22_ADC1.2 R23_ADC1.1 U1_ADC1.18), MCU_DAQ (U11.53)
PC0: MCU_DAQ (U11.15), Phase_Modulator_Transmitter (R151.1 U23.10)
PC1: MCU_DAQ (U11.16), Phase_Modulator_Transmitter (R153.1 U23.9)
PC2: MCU_DAQ (U11.17), Phase_Modulator_Transmitter (R157.1 R160.2 U24.2 X5.1)
PC3: MCU_DAQ (U11.18), Phase_Modulator_Transmitter (U23.13)
PE8: OPTO_ISOLATION (U20.13), MCU_DAQ (U11.38)
PE9: OPTO_ISOLATION (U20.14), MCU_DAQ (U11.39)
PE11: OPTO_ISOLATION (U20.15), MCU_DAQ (U11.41)
PE12: OPTO_ISOLATION (U20.18), MCU_DAQ (U11.42), INPUTS_OUTPUTS (R93.3)
SCL: OPTO_ISOLATION (R35.2 U19.6), DIAGNOSTIC_ADC (U5.3), INPUTS_OUTPUTS (R93.2)
SDA: OPTO_ISOLATION (R34.2 U19.7), DIAGNOSTIC_ADC (U5.2), INPUTS_OUTPUTS (R93.1)
SPI_CS_WIFI_BLE: WIFI_BLE_Option (U44.4), MCU_USB (U14.29)
SPI_MISO_WIFI_BLE: WIFI_BLE_Option (U44.2), MCU_USB (U14.79)
SPI_MOSI_WIFI_BLE: WIFI_BLE_Option (U44.3), MCU_USB (U14.80)
SPI_SCLK_WIFI_BLE: WIFI_BLE_Option (U44.38), MCU_USB (U14.78)
UART_CTS_WIFI_BLE: WIFI_BLE_Option (U44.18), MCU_USB (U14.56)
UART_RTS_WIFI_BLE: WIFI_BLE_Option (U44.20), MCU_USB (U14.55)
UART_RX_WIFI_BLE: WIFI_BLE_Option (U44.17), MCU_USB (U14.39)
UART_TX_WIFI_BLE: WIFI_BLE_Option (U44.19), MCU_USB (U14.38)
USB_ID: USB (R236.1 R241.2), MCU_USB (U14.31)
USB_RENUM: USB (R251.2), MCU_USB (U14.33)
WIFI_BLE_ENABLE: WIFI_BLE_Option (R257.2), MCU_USB (U14.63)